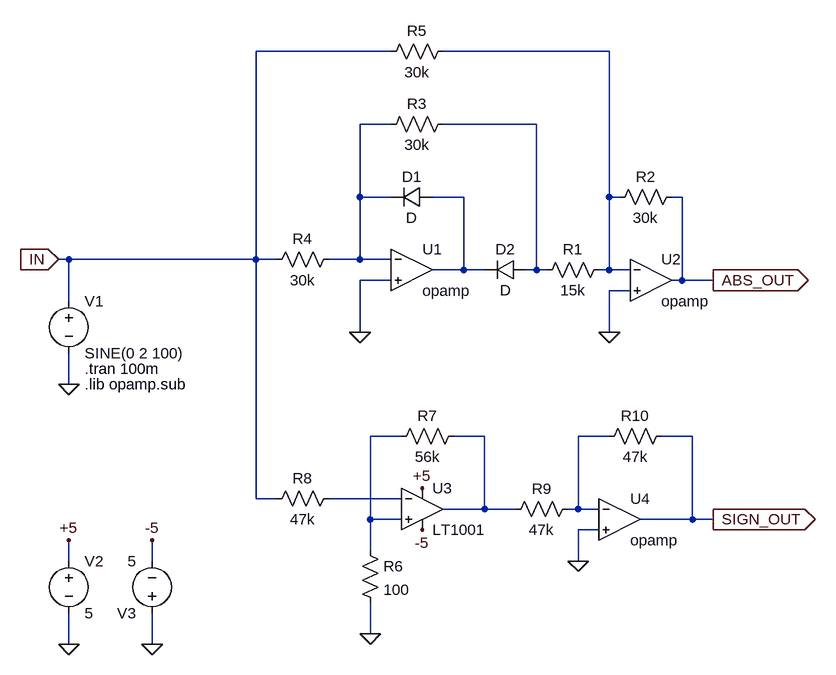
[diagram p0: schematic abs_value_and_sign_detector.asc]
abs_value_and_sign_detector.asc, the LTspice schematic file:
Version 4
SHEET 1 1288 868
WIRE 272 -128 64 -128
WIRE 608 -128 352 -128
WIRE 272 -16 224 -16
WIRE 496 -16 352 -16
WIRE 224 96 224 -16
WIRE 272 96 224 96
WIRE 384 96 336 96
WIRE 608 96 608 -128
WIRE 624 96 608 96
WIRE 720 96 704 96
WIRE -224 192 -240 192
WIRE 64 192 64 -128
WIRE 64 192 -224 192
WIRE 96 192 64 192
WIRE 224 192 224 96
WIRE 224 192 176 192
WIRE 272 192 224 192
WIRE 384 208 384 96
WIRE 384 208 336 208
WIRE 416 208 384 208
WIRE 496 208 496 -16
WIRE 496 208 480 208
WIRE 512 208 496 208
WIRE 608 208 608 96
WIRE 608 208 592 208
WIRE 640 208 608 208
WIRE 272 224 224 224
WIRE 720 224 720 96
WIRE 720 224 704 224
WIRE 768 224 720 224
WIRE 640 240 608 240
WIRE -224 256 -224 192
WIRE 224 304 224 224
WIRE 608 304 608 240
WIRE -224 384 -224 336
WIRE 288 464 240 464
WIRE 416 464 368 464
WIRE 608 464 560 464
WIRE 736 464 688 464
WIRE 64 560 64 192
WIRE 96 560 64 560
WIRE 288 560 176 560
WIRE 416 576 416 464
WIRE 416 576 352 576
WIRE 464 576 416 576
WIRE 560 576 560 464
WIRE 560 576 544 576
WIRE 592 576 560 576
WIRE 240 592 240 464
WIRE 288 592 240 592
WIRE 736 592 736 464
WIRE 736 592 656 592
WIRE 768 592 736 592
WIRE 592 608 560 608
WIRE 240 640 240 592
WIRE -224 656 -224 624
WIRE -96 656 -96 624
WIRE 560 656 560 608
WIRE 240 768 240 720
WIRE -224 784 -224 736
WIRE -96 784 -96 736
FLAG 224 304 0
FLAG 608 304 0
FLAG 768 224 ABS_OUT
IOPIN 768 224 Out
FLAG -240 192 IN
IOPIN -240 192 In
FLAG 240 768 0
FLAG 560 656 0
FLAG 768 592 SIGN_OUT
IOPIN 768 592 Out
FLAG -224 384 0
FLAG -224 784 0
FLAG -96 784 0
FLAG -224 624 +5
FLAG -96 624 -5
FLAG 320 544 +5
FLAG 320 608 -5
SYMBOL OpAmps\\opamp 304 144 R0
SYMATTR InstName U1
SYMBOL diode 336 80 R90
WINDOW 0 0 32 VBottom 2
WINDOW 3 32 32 VTop 2
SYMATTR InstName D1
SYMBOL diode 480 192 R90
WINDOW 0 0 32 VBottom 2
WINDOW 3 32 32 VTop 2
SYMATTR InstName D2
SYMBOL res 608 192 R90
WINDOW 0 0 56 VBottom 2
WINDOW 3 32 56 VTop 2
SYMATTR InstName R1
SYMATTR Value 15k
SYMBOL OpAmps\\opamp 672 160 R0
SYMATTR InstName U2
SYMBOL res 720 80 R90
WINDOW 0 0 56 VBottom 2
WINDOW 3 32 56 VTop 2
SYMATTR InstName R2
SYMATTR Value 30k
SYMBOL res 368 -32 R90
WINDOW 0 0 56 VBottom 2
WINDOW 3 32 56 VTop 2
SYMATTR InstName R3
SYMATTR Value 30k
SYMBOL res 192 176 R90
WINDOW 0 0 56 VBottom 2
WINDOW 3 32 56 VTop 2
SYMATTR InstName R4
SYMATTR Value 30k
SYMBOL res 368 -144 R90
WINDOW 0 0 56 VBottom 2
WINDOW 3 32 56 VTop 2
SYMATTR InstName R5
SYMATTR Value 30k
SYMBOL res 224 624 R0
SYMATTR InstName R6
SYMATTR Value 100
SYMBOL res 384 448 R90
WINDOW 0 0 56 VBottom 2
WINDOW 3 32 56 VTop 2
SYMATTR InstName R7
SYMATTR Value 56k
SYMBOL res 192 544 R90
WINDOW 0 0 56 VBottom 2
WINDOW 3 32 56 VTop 2
SYMATTR InstName R8
SYMATTR Value 47k
SYMBOL res 560 560 R90
WINDOW 0 0 56 VBottom 2
WINDOW 3 32 56 VTop 2
SYMATTR InstName R9
SYMATTR Value 47k
SYMBOL OpAmps\\opamp 624 528 R0
SYMATTR InstName U4
SYMBOL res 704 448 R90
WINDOW 0 0 56 VBottom 2
WINDOW 3 32 56 VTop 2
SYMATTR InstName R10
SYMATTR Value 47k
SYMBOL voltage -224 240 R0
WINDOW 123 0 0 Left 0
WINDOW 39 0 0 Left 0
SYMATTR InstName V1
SYMATTR Value SINE(0 2 100)
SYMBOL voltage -224 640 R0
WINDOW 123 0 0 Left 0
WINDOW 39 0 0 Left 0
SYMATTR InstName V2
SYMATTR Value 5
SYMBOL voltage -96 752 R180
WINDOW 123 0 0 Left 0
WINDOW 39 0 0 Left 0
SYMATTR InstName V3
SYMATTR Value 5
SYMBOL OpAmps\\LT1001 320 512 R0
SYMATTR InstName U3
TEXT -200 360 Left 2 !.tran 100m
TEXT -200 384 Left 2 !.lib opamp.sub

The netlist it stands for:
* abs_value_and_sign_detector.asc
XU1 N002 0 N004 opamp Aol=100K GBW=10Meg  ; pins invin noninvin out
D1 N004 N002 D
D2 N003 N004 D
R1 N001 N003 15k
XU2 N001 0 ABS_OUT opamp Aol=100K GBW=10Meg  ; pins invin noninvin out
R2 ABS_OUT N001 30k
R3 N003 N002 30k
R4 N002 IN 30k
R5 N001 IN 30k
R6 N005 0 100
R7 N006 N005 56k
R8 N008 IN 47k
R9 N007 N006 47k
XU4 N007 0 SIGN_OUT opamp Aol=100K GBW=10Meg  ; pins invin noninvin out
R10 SIGN_OUT N007 47k
V1 IN 0 SINE(0 2 100)
V2 +5 0 5
V3 0 -5 5
XU3 N005 N008 +5 -5 N006 LT1001  ; pins In+ In- V+ V- OUT
.model D D
.lib standard.dio
.tran 100m
.lib opamp.sub
.lib LTC.lib
.backanno
.end